# Altium schematic sheet SIM800.SchDoc
size A4
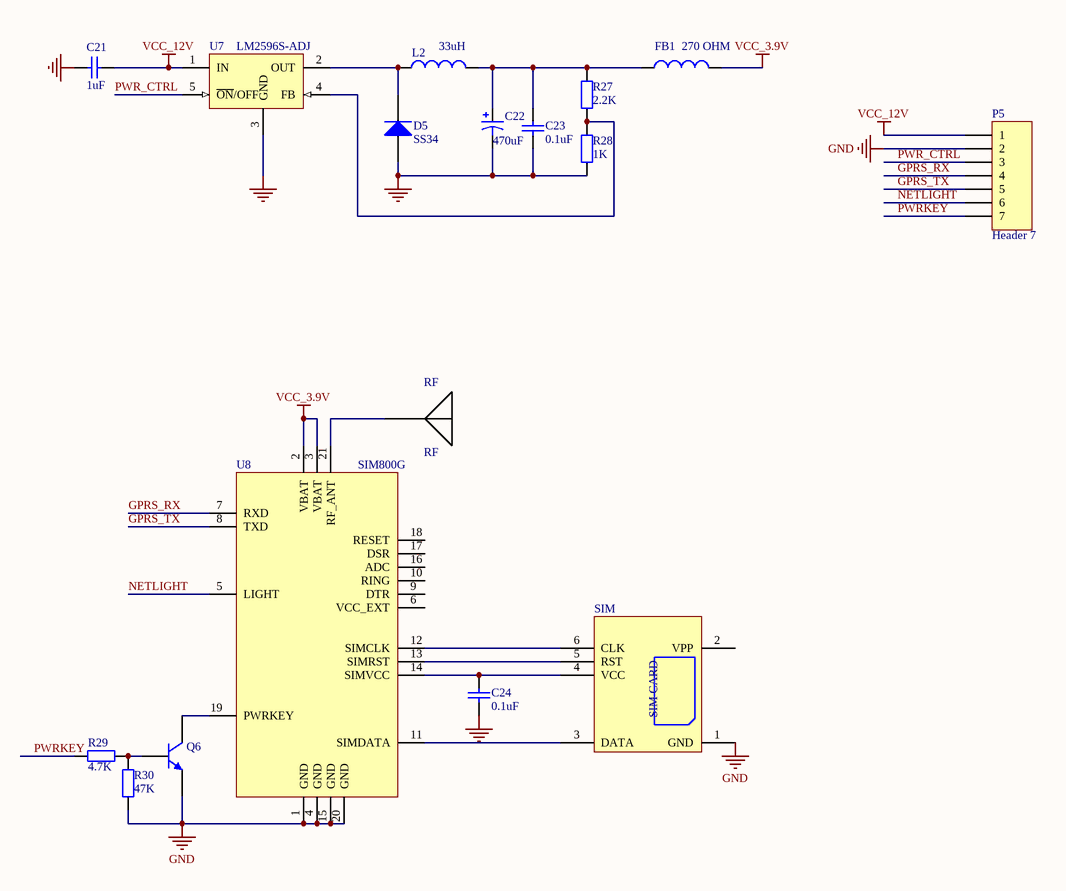
[diagram p0: SIM800.SchDoc]

## Parts
C21  value 1uF  [0603]  (hidden comment: Cap)
C22  value 470uF  [C_DJ - duplicate]  (hidden comment: Cap Pol1)
C23  value 0.1uF  [0603]  (hidden comment: Cap)
C24  value 0.1uF  [0603]  (hidden comment: Cap)
D5  SS34  [M7-4007]
FB1  value 270 OHM  [0805]  (hidden comment: Inductor)
L2  value 33uH  [L12*12]  (hidden comment: Inductor)
P5  Header 7  [HDR1X7]
Q6  (no value)  [NPN-PNP]
R27  value 2.2K  [0603]  (hidden comment: Res2)
R28  value 1K  [0603]  (hidden comment: Res2)
R29  value 4.7K  [0603]  (hidden comment: Res2)
R30  value 47K  [0603]  (hidden comment: Res2)
RF  RF  [RF_2]
SIM  (no value)  [SIMCARD]
U7  LM2596S-ADJ  [TO-263-5]
U8  SIM800G  [M590E_1]

## Nets
GND: C21.2 C22.2 C23.1 C24.2 D5.1(A) P5.2 Q6.E R28.2 R30.2 SIM.1(GND) U7.3(GND) U8.1(GND) U8.4(GND) U8.15(GND) U8.20(GND)
VCC_3.9V: FB1.2 U8.2(VBAT) U8.3(VBAT)
VCC_12V: C21.1 P5.1 U7.1(IN)
GPRS_RX: P5.4 U8.7(RXD)
GPRS_TX: P5.5 U8.8(TXD)
NETLIGHT: P5.6 U8.5(LIGHT)
PWR_CTRL: P5.3 U7.5(~{ON}/OFF)
PWRKEY: P5.7 R29.1
NetC22_1: C22.1 C23.2 FB1.1 L2.2 R27.1
NetC24_1: C24.1 SIM.4(VCC) U8.14(SIMVCC)
NetD5_2: D5.2(K) L2.1 U7.2(OUT)
NetQ6_B: Q6.B R29.2 R30.1
NetQ6_C: Q6.C U8.19(PWRKEY)
NetR27_2: R27.2 R28.1 U7.4(FB)
NetRF_1: RF.1(RF) U8.21(RF_ANT)
NetSIM_3: SIM.3(DATA) U8.11(SIMDATA)
NetSIM_5: SIM.5(RST) U8.13(SIMRST)
NetSIM_6: SIM.6(CLK) U8.12(SIMCLK)

Not connected (* = marked no-connect by the designer): SIM 2(VPP); U8 6(VCC_EXT) 9(DTR) 10(RING) 16(ADC) 17(DSR) 18(RESET)

## Library data of the parts
C21 C23 C24 = Cap: Capacitor; Published: 8-Jun-2000; LatestRevisionDate: 17-Jul-2002; LatestRevisionNote: Re-released for DXP Platform.; PackageReference: RAD-0.3; Publisher: Altium Limited
C22 = Cap Pol1: Polarized Capacitor (Radial); Published: 8-Jun-2000; LatestRevisionDate: 17-Jul-2002; LatestRevisionNote: Re-released for DXP Platform.; PackageReference: RB7.6-15; Publisher: Altium Limited
D5 = Diode 1N4007: 1 Amp General Purpose Rectifier; Published: 8-Jun-2000; LatestRevisionDate: 17-Jul-2002; LatestRevisionNote: Re-released for DXP Platform.; DatasheetVersion: 1998; PackageVersion: Aug-1999; PackageReference: DO-41; Publisher: Altium Limited; Code_JEDEC: DO-204-AL; ComponentLink1Description: Manufacturer Link; ComponentLink1URL: http://www.fairchildsemi.com/; ComponentLink2Description: Datasheet; ComponentLink2URL: http://www.fairchildsemi.com/ds/1N%2F1N4001.pdf
FB1 L2 = Inductor: Code_IEC: 1005; Published: 8-Jun-2000; LatestRevisionDate: 29-May-2009; LatestRevisionNote: IPC-7351 Footprint Added.; PackageReference: 0402-A; Publisher: Altium Limited; PackageDescription: Chip Inductor; Code_JEITA: 0402
P5 = Header 7: Header, 7-Pin; LatestRevisionDate: 17-Jul-2002; LatestRevisionNote: Re-released for DXP Platform.; Publisher: Altium Limited
Q6 = 2N3904: NPN General Purpose Amplifier; Published: 8-Jun-2000; LatestRevisionDate: 15-Jan-2003; LatestRevisionNote: PCB Footprint 'BCY-W3/D4.7' replaced; DatasheetDocument: 1997; PackageDocument: Sep-1998; PackageReference: TO-92A; Publisher: Altium Limited; Code_JEDEC: TO-92A; ComponentLink1Description: Manufacturer Link; ComponentLink1URL: http://www.fairchildsemi.com/; ComponentLink2Description: Datasheet; ComponentLink2URL: http://www.fairchildsemi.com/ds/2N%2F2N3904.pdf
R27-R30 = Res2: Resistor; Published: 8-Jun-2000; LatestRevisionDate: 17-Jul-2002; LatestRevisionNote: Re-released for DXP Platform.; PackageReference: AXIAL-0.4; Publisher: Altium Limited
SIM = SIM_CARD: SIM CARD
U7 = LM2596S-5.0: 5V稳压芯片; Note: Tab is connected to GND; Published: 15-Apr-2002; DatasheetVersion: Dec-1997; PackageReference: TS5B; Publisher: Altium Limited; PackageDescription: D2-PAK; 5 Leads; Body 14.4 (inc. leads) x 10.4 mm (LxW max); ComponentLink1Description: Manufacturer Link; ComponentLink1URL: http://www.national.com/; ComponentLink2Description: Datasheet; ComponentLink2URL: http://www.national.com/ds.cgi/LM/LM2596.pdf; ComponentLink3Description: URL Link1; ComponentLink3URL: http://www.national.com/pf/LM/LM2596.html
U8 = M590